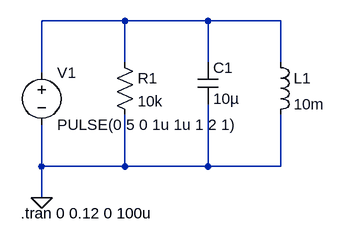
[diagram p0: schematic Circuito1.asc]
Circuito1.asc, the LTspice schematic file:
Version 4.1
SHEET 1 880 680
WIRE 80 16 -48 16
WIRE 208 16 80 16
WIRE 320 16 208 16
WIRE 80 80 80 16
WIRE 208 80 208 16
WIRE 320 80 320 16
WIRE -48 96 -48 16
WIRE -48 240 -48 176
WIRE 80 240 80 160
WIRE 80 240 -48 240
WIRE 208 240 208 144
WIRE 208 240 80 240
WIRE 320 240 320 160
WIRE 320 240 208 240
WIRE -48 288 -48 240
FLAG -48 288 0
SYMBOL res 64 64 R0
SYMATTR InstName R1
SYMATTR Value 10k
SYMBOL cap 192 80 R0
SYMATTR InstName C1
SYMATTR Value 10µ
SYMBOL ind 304 64 R0
SYMATTR InstName L1
SYMATTR Value 10m
SYMBOL voltage -48 80 R0
WINDOW 123 0 0 Left 0
WINDOW 39 0 0 Left 0
SYMATTR InstName V1
SYMATTR Value PULSE(0 5 0 1u 1u 1 2 1)
TEXT -80 312 Left 2 !.tran 0 0.12 0 100u

The netlist it stands for:
* Circuito1.asc
R1 N001 0 10k
C1 N001 0 10µ
L1 N001 0 10m
V1 N001 0 PULSE(0 5 0 1u 1u 1 2 1)
.tran 0 0.12 0 100u
.backanno
.end